# Altium schematic sheet MainBoard_V1p0_PSU.SchDoc
size A4; SheetNumber: 2; SheetTotal: 8
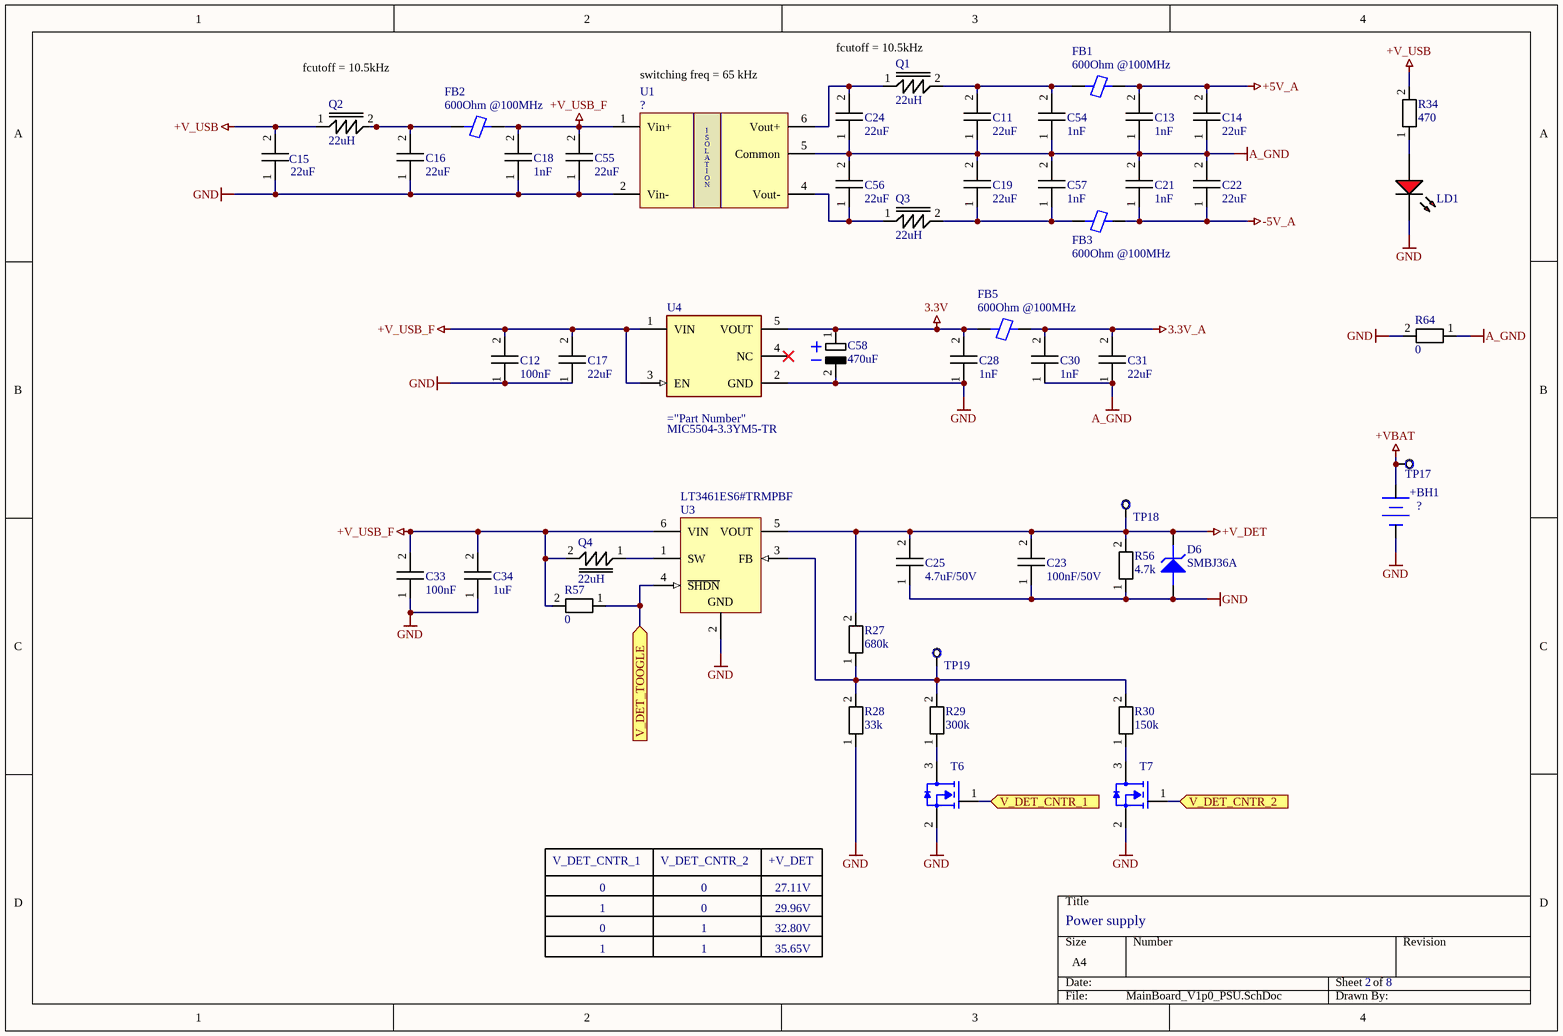
[diagram p0: MainBoard_V1p0_PSU.SchDoc]

## Parts
BH1  ?  [BATTERY_HOLDER_KEYSTONE_3002]
C11  22uF  [1210_C]
C12  100nF  [0805_C]
C13  1nF  [0805_C]
C14  22uF  [1210_C]
C15  22uF  [1210_C]
C16  22uF  [0805_C]
C17  22uF  [1210_C]
C18  1nF  [0805_C]
C19  22uF  [1210_C]
C21  1nF  [0805_C]
C22  22uF  [1210_C]
C23  100nF/50V  [0805_C]
C24  22uF  [1210_C]
C25  4.7uF/50V  [0805_C]
C28  1nF  [0805_C]
C30  1nF  [0805_C]
C31  22uF  [1210_C]
C33  100nF  [0805_C]
C34  1uF  [0805_C]
C54  1nF  [0805_C]
C55  22uF  [1210_C]
C56  22uF  [1210_C]
C57  1nF  [0805_C]
C58  470uF  [CAPAE9383X110M]
D6  SMBJ36A  [DO-214AA (SMB)]
FB1  600Ohm @100MHz  [0805_FB]
FB2  600Ohm @100MHz  [0805_FB]
FB3  600Ohm @100MHz  [0805_FB]
FB5  600Ohm @100MHz  [0805_FB]
LD1  LED_RED  [LED_SMD_90DEG_RED]  (value not drawn)
Q1  22uH  [1210]
Q2  22uH  [1210]
Q3  22uH  [1210]
Q4  22uH  [1210]
R27  680k  [0805]
R28  33k  [0805]
R29  300k  [0805]
R30  150k  [0805]
R34  470  [0805]
R56  4.7k  [0805]
R57  0  [0805]
R64  0  [0805]
T6  MMBF170  [SOT23]  (value not drawn)
T7  MMBF170  [SOT23]  (value not drawn)
TP17  ?  [PAD_40]  (value not drawn)  (no BOM)
TP18  ?  [PAD_40]  (value not drawn)  (no BOM)
TP19  ?  [PAD_40]  (value not drawn)  (no BOM)
U1  ?  [SIP_6]
U3  LT3461ES6#TRMPBF  [LT-S6-6-TSOT-23_L]
U4  MIC5504-3.3YM5-TR  [SOT23-5]

## Ports
V_DET_CNTR_1 (in), V_DET_CNTR_2 (in), V_DET_TOOGLE (in)

## Nets
3.3V: C28.2 C58.1 FB5.1 U4.5(VOUT)
3.3V_A: C30.2 C31.2 FB5.2
+5V_A: C13.2 C14.2 FB1.2
+V_DET: C23.2 C25.2 D6.K R27.2 R56.2 TP18.1 U3.5(VOUT)
+V_USB: C15.2 Q2.1 R34.2
+V_USB_F: C12.2 C17.2 C18.2 C33.2 C34.2 C55.2 FB2.2 Q4.2 R57.2 U1.1(Vin+) U3.6(VIN) U4.1(VIN) U4.3(EN)
+VBAT: BH1.1 TP17.1
-5V_A: C21.1 C22.1 FB3.2
A_GND: C11.1 C13.1 C14.1 C19.2 C21.2 C22.2 C24.1 C30.1 C31.1 C54.1 C56.2 C57.2 R64.1 U1.5(Common)
GND: BH1.2 C12.1 C15.1 C16.1 C17.1 C18.1 C23.1 C25.1 C28.1 C33.1 C34.1 C55.1 C58.2 D6.A LD1.K R28.1 R56.1 R64.2 T6.2(Source) T7.2(Source) U1.2(Vin-) U3.2(GND) U4.2(GND)
V_DET_CNTR_1: T6.1(Gate) ; port V_DET_CNTR_1
V_DET_CNTR_2: T7.1(Gate) ; port V_DET_CNTR_2
V_DET_TOOGLE: R57.1 U3.4(~{SHDN}) ; port V_DET_TOOGLE
NetC11_2: C11.2 C54.2 FB1.1 Q1.2
NetC16_2: C16.2 FB2.1 Q2.2
NetC19_1: C19.1 C57.1 FB3.1 Q3.2
NetC24_2: C24.2 Q1.1 U1.6(Vout+)
NetC56_1: C56.1 Q3.1 U1.4(Vout-)
NetLD1_A: LD1.A R34.1
NetQ4_1: Q4.1 U3.1(SW)
NetR27_1: R27.1 R28.2 R29.2 R30.2 TP19.1 U3.3(FB)
NetR29_1: R29.1 T6.3(Drain)
NetR30_1: R30.1 T7.3(Drain)

Not connected (* = marked no-connect by the designer): U4 4(NC)*

## Notes on the sheet
- fcutoff = 10.5kHz
- (near U1) switching freq = 65 kHz
- (near Q1) fcutoff = 10.5kHz
- V_DET_CNTR_1
- 0
- 1
- V_DET_CNTR_2
- +V_DET
- 27.11V
- 29.96V
- Power supply
- 32.80V
- 35.65V
- 2     8
- (in symbol BATTERY_HOLDER) +
- (in symbol NKA0505SC) I; S; O; L; A; T; N

## Library data of the parts
BH1 = BATTERY_HOLDER: KEYSTONE 3002 (CR2032); OrderNumber: 1650693; Supplier: FARNELL
C11-C19 C21-C25 C28 C30 C31 C33 C34 C54-C57 = CAPACITOR
C58 = CAPACITOR_ELCO
D6 = DIODE_TVS
FB1-FB3 FB5 = FERRITE_BEAD
LD1 = LED_RED: Type (0°): LTSTC170CKT; Type (90°): HSMS-C110
Q1-Q4 = COIL
R27-R30 R34 R56 R57 R64 = RESISTOR: Parameter 1: 10k
T6 T7 = MMBF170: N MOSFET
TP17-TP19 = TESTPOINT
U1 = NKA0505SC: MEA1D0505SC Isolated DC/DC Converters +/-5V 100mA
U3 = LT3461: 1.3 MHz Step-Up DC/DC Converter with Integrated Schottky, 6-pin SOT23 (S6-6), -40 to 85 degC, Pb-Free, Mini Tape and Reel; ComponentLink1Description: Datasheet; ComponentLink1URL: http://cds.linear.com/docs/en/datasheet/3461af.pdf